# Altium project eeg-measurement-circuit.PrjPcb (part 1 of 3)
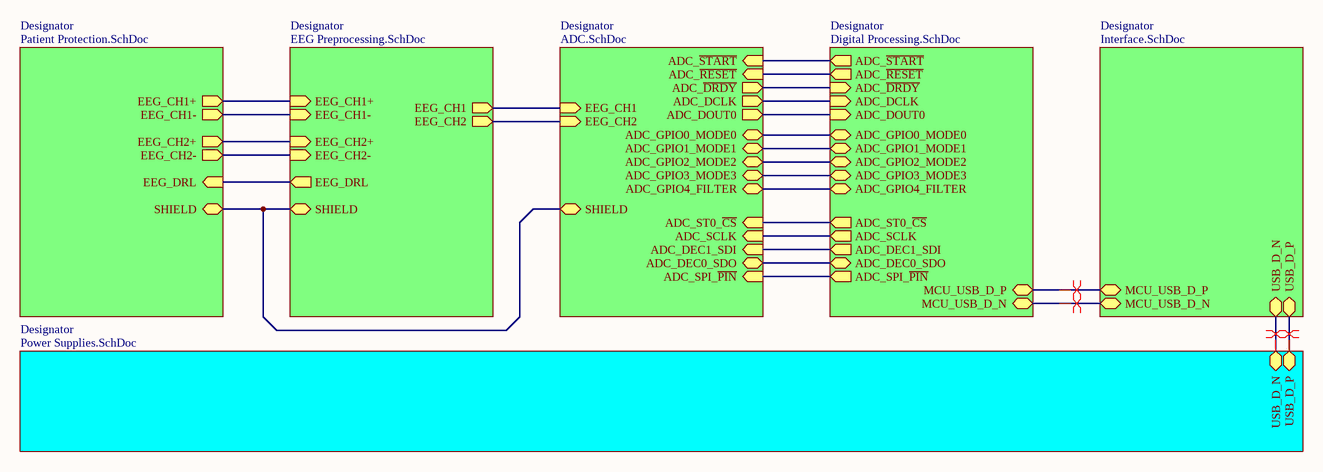
[diagram p0: Block Diagram.SchDoc]
7 sheets, 331 parts. Net scope: hierarchical (ports join the sheet entries above them; power ports are global).
Board files: PCB1.PcbDoc, PCB2.PcbDoc
Sheets:
  Block Diagram.SchDoc
    Designator = Power Supplies.SchDoc
    Designator = EEG Preprocessing.SchDoc
    Designator = ADC.SchDoc
    Designator = Digital Processing.SchDoc
    Designator = Interface.SchDoc
    Designator = Patient Protection.SchDoc

## Sheet Block Diagram.SchDoc: EEG Measurement Circuit
size A3; Date: 24/01/2025; DrawnBy: Giang Phan Truong; Revision: 1.1.0; SheetNumber: 1; SheetTotal: 7

### Sub-sheets
Designator = Power Supplies.SchDoc: USB_D_N (bidir), USB_D_P (bidir)
Designator = EEG Preprocessing.SchDoc: EEG_CH1+ (in), EEG_CH1- (in), EEG_CH2+ (in), EEG_CH2- (in), EEG_CH1 (out), EEG_CH2 (out), EEG_DRL (out), SHIELD (bidir)
Designator = ADC.SchDoc: EEG_CH2 (in), EEG_CH1 (in), SHIELD (bidir), ADC_GPIO0_MODE0 (bidir), ADC_GPIO1_MODE1 (bidir), ADC_GPIO2_MODE2 (bidir), ADC_GPIO3_MODE3 (bidir), ADC_GPIO4_FILTER (bidir), ADC_ST0_~{CS} (in), ADC_SCLK (in), ADC_DEC1_SDI (in), ADC_DEC0_SDO (bidir), ADC_SPI_~{PIN} (in), ADC_~{START} (in), ADC_~{RESET} (in), ADC_~{DRDY} (out), ADC_DCLK (out), ADC_DOUT0 (out)
Designator = Digital Processing.SchDoc: ADC_GPIO0_MODE0 (bidir), ADC_GPIO1_MODE1 (bidir), ADC_GPIO2_MODE2 (bidir), ADC_GPIO3_MODE3 (bidir), ADC_GPIO4_FILTER (bidir), ADC_ST0_~{CS} (out), ADC_SCLK (out), ADC_DEC1_SDI (out), ADC_DEC0_SDO (bidir), ADC_SPI_~{PIN} (out), ADC_~{START} (out), ADC_~{RESET} (out), ADC_~{DRDY} (in), ADC_DCLK (in), ADC_DOUT0 (in), MCU_USB_D_P (bidir), MCU_USB_D_N (bidir)
Designator = Interface.SchDoc: USB_D_P (bidir), USB_D_N (bidir), MCU_USB_D_P (bidir), MCU_USB_D_N (bidir)
Designator = Patient Protection.SchDoc: EEG_CH1+ (out), EEG_CH1- (out), EEG_CH2- (out), EEG_CH2+ (out), EEG_DRL (in), SHIELD (bidir)

### Nets
GPIO0_MODE0: sheet Designator/ADC_GPIO0_MODE0, sheet Designator/ADC_GPIO0_MODE0
GPIO1_MODE1: sheet Designator/ADC_GPIO1_MODE1, sheet Designator/ADC_GPIO1_MODE1
GPIO2_MODE2: sheet Designator/ADC_GPIO2_MODE2, sheet Designator/ADC_GPIO2_MODE2
GPIO3_MODE3: sheet Designator/ADC_GPIO3_MODE3, sheet Designator/ADC_GPIO3_MODE3
GPIO4_FILTER: sheet Designator/ADC_GPIO4_FILTER, sheet Designator/ADC_GPIO4_FILTER
MCU_USB_D_N: sheet Designator/MCU_USB_D_N, sheet Designator/MCU_USB_D_N
MCU_USB_D_P: sheet Designator/MCU_USB_D_P, sheet Designator/MCU_USB_D_P
SHIELD: sheet Designator/SHIELD, sheet Designator/SHIELD, sheet Designator/SHIELD
USB_D_N: sheet Designator/USB_D_N, sheet Designator/USB_D_N
USB_D_P: sheet Designator/USB_D_P, sheet Designator/USB_D_P
NetC300_2: sheet Designator/EEG_CH1+, sheet Designator/EEG_CH1+
NetC301_2: sheet Designator/EEG_CH1, sheet Designator/EEG_CH1
NetC303_1: sheet Designator/EEG_CH1-, sheet Designator/EEG_CH1-
NetC309_2: sheet Designator/EEG_CH2+, sheet Designator/EEG_CH2+
NetC310_2: sheet Designator/EEG_CH2, sheet Designator/EEG_CH2
NetC312_1: sheet Designator/EEG_CH2-, sheet Designator/EEG_CH2-
NetC318_1: sheet Designator/EEG_DRL, sheet Designator/EEG_DRL
NetR413_2: sheet Designator/ADC_~{START}, sheet Designator/ADC_~{START}
NetR414_2: sheet Designator/ADC_~{RESET}, sheet Designator/ADC_~{RESET}
NetR420_2: sheet Designator/ADC_SPI_~{PIN}, sheet Designator/ADC_SPI_~{PIN}
NetU400_16: sheet Designator/ADC_ST0_~{CS}, sheet Designator/ADC_ST0_~{CS}
NetU400_17: sheet Designator/ADC_SCLK, sheet Designator/ADC_SCLK
NetU400_18: sheet Designator/ADC_DEC1_SDI, sheet Designator/ADC_DEC1_SDI
NetU400_19: sheet Designator/ADC_DEC0_SDO, sheet Designator/ADC_DEC0_SDO
NetU400_27: sheet Designator/ADC_DOUT0, sheet Designator/ADC_DOUT0
NetU400_28: sheet Designator/ADC_DCLK, sheet Designator/ADC_DCLK
NetU400_29: sheet Designator/ADC_~{DRDY}, sheet Designator/ADC_~{DRDY}

### Layout directives
differential pair: MCU_USB_D_N, MCU_USB_D_P, USB_D_N, USB_D_P

### Notes on the sheet
- Project Name:
- Size
- Size:
- A3
- Revision:
- Drawn By:
- Date:
- File:
- Last Modified:
- Checked By:
- Sheet
- of

## Sheet Power Supplies.SchDoc: EEG Measurement Circuit
size A3; Date: 24/01/2025; DrawnBy: Giang Phan Truong; SheetNumber: 2; SheetTotal: 7
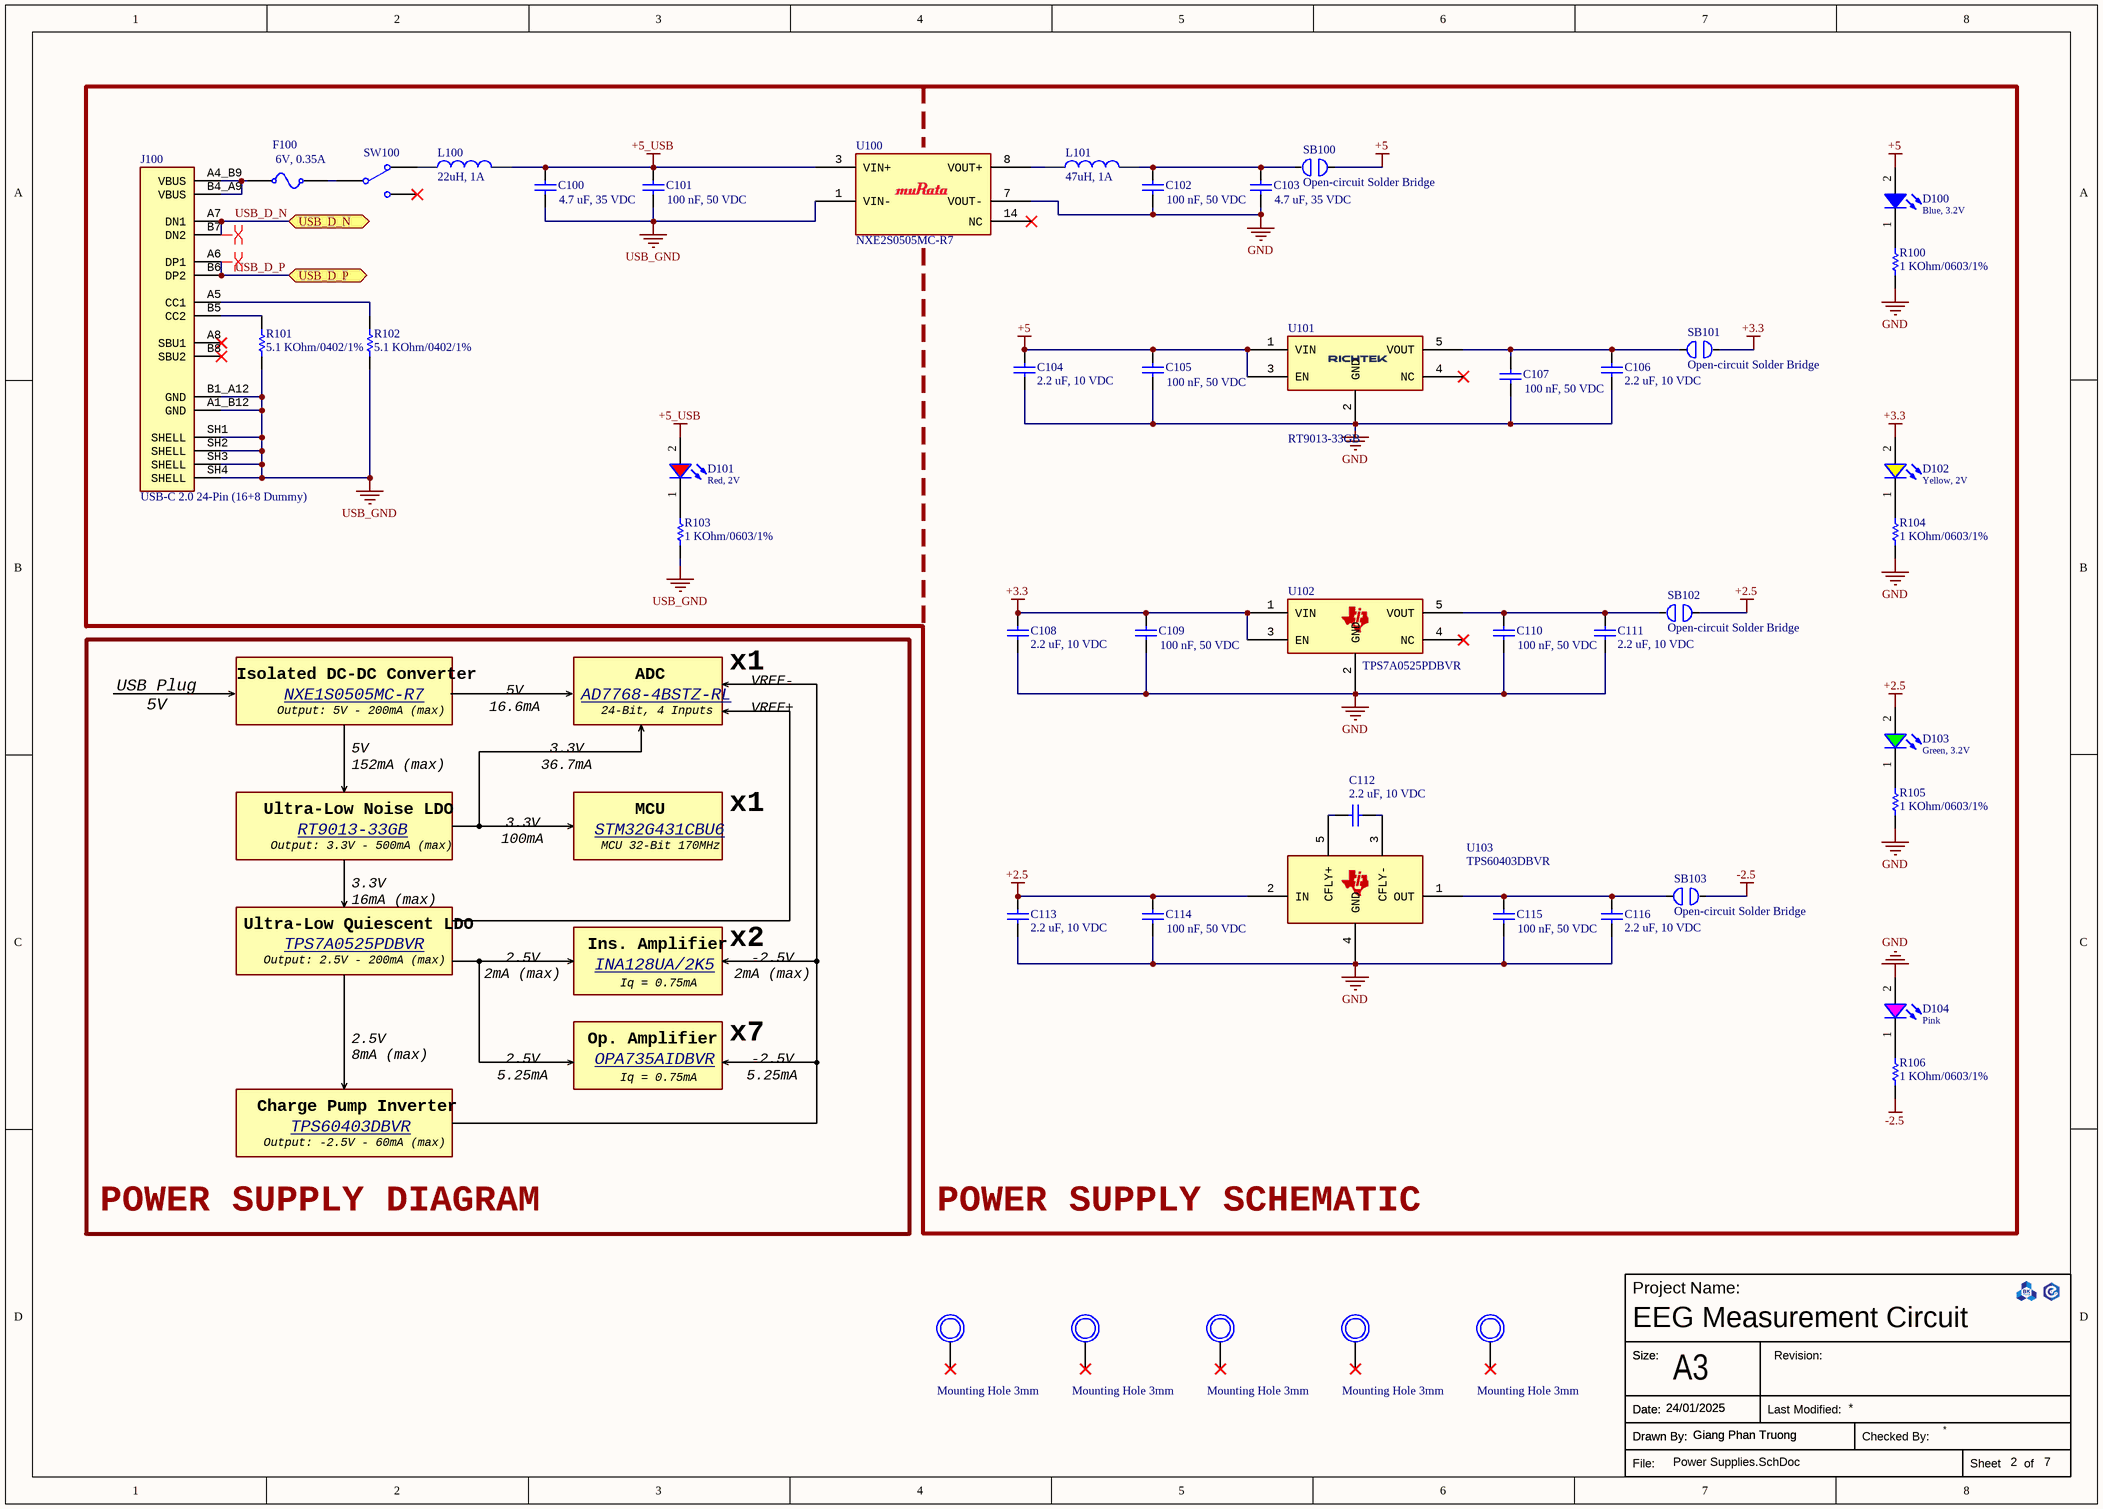
[diagram p1: Power Supplies.SchDoc]

### Parts
C100  4.7 uF, 35 VDC  [CAP_0603]
C101  100 nF, 50 VDC  [CAP_0603]
C102  100 nF, 50 VDC  [CAP_0603]
C103  4.7 uF, 35 VDC  [CAP_0603]
C104  2.2 uF, 10 VDC  [CAP_0603]
C105  100 nF, 50 VDC  [CAP_0603]
C106  2.2 uF, 10 VDC  [CAP_0603]
C107  100 nF, 50 VDC  [CAP_0603]
C108  2.2 uF, 10 VDC  [CAP_0603]
C109  100 nF, 50 VDC  [CAP_0603]
C110  100 nF, 50 VDC  [CAP_0603]
C111  2.2 uF, 10 VDC  [CAP_0603]
C112  2.2 uF, 10 VDC  [CAP_0603]
C113  2.2 uF, 10 VDC  [CAP_0603]
C114  100 nF, 50 VDC  [CAP_0603]
C115  100 nF, 50 VDC  [CAP_0603]
C116  2.2 uF, 10 VDC  [CAP_0603]
D100  Blue, 3.2V  [WL-SMCW_0603_H=0.7mm]
D101  Red, 2V  [WL-SMCW_0603_H=0.7mm]
D102  Yellow, 2V  [WL-SMCW_0603_H=0.7mm]
D103  Green, 3.2V  [WL-SMCW_0603_H=0.7mm]
D104  Pink  [WL-SMCW_0603_H=0.7mm]
F100  6V, 0.35A  [Fuse_SMD_1206]
H100  Mounting Hole 3mm  [3mm with via]
H101  Mounting Hole 3mm  [3mm with via]
H102  Mounting Hole 3mm  [3mm with via]
H103  Mounting Hole 3mm  [3mm with via]
H?  Mounting Hole 3mm  [3mm with via]
J100  value USB-C 2.0 24-Pin (16+8 Dummy)  [GCT_USB4105-GF-A]  (hidden comment: USB4105-GF-A)
L100  22uH, 1A  [Inductor_CDRH4D28]
L101  47uH, 1A  [Inductor_CDRH4D28]
R100  value 1 KOhm/0603/1%  [R0603]  (hidden comment: Resistor 1 KOhm 0603 1%)
R101  value 5.1 KOhm/0402/1%  [R0402]  (hidden comment: Resistor 5.1 KOhm 0402)
R102  value 5.1 KOhm/0402/1%  [R0402]  (hidden comment: Resistor 5.1 KOhm 0402)
R103  value 1 KOhm/0603/1%  [R0603]  (hidden comment: Resistor 1 KOhm 0603 1%)
R104  value 1 KOhm/0603/1%  [R0603]  (hidden comment: Resistor 1 KOhm 0603 1%)
R105  value 1 KOhm/0603/1%  [R0603]  (hidden comment: Resistor 1 KOhm 0603 1%)
R106  value 1 KOhm/0603/1%  [R0603]  (hidden comment: Resistor 1 KOhm 0603 1%)
SB100  Open-circuit Solder Bridge  [SolderBridgeOpen]
SB101  Open-circuit Solder Bridge  [SolderBridgeOpen]
SB102  Open-circuit Solder Bridge  [SolderBridgeOpen]
SB103  Open-circuit Solder Bridge  [SolderBridgeOpen]
SW100  450404015514  [450404015514]  (value not drawn)
U100  NXE2S0505MC-R7  [NXE2_SINGLE_SURFACE_MUR]
U101  RT9013-33GB  [SOT-23-5_RIT-L]
U102  TPS7A0525PDBVR  [DBV0005A_L]
U103  TPS60403DBVR  [SOT95P280X145-5N]

### Blocks framed on the sheet
POWER SUPPLY SCHEMATIC: C100-C116 D100-D104 F100 J100 L100 L101 R100-R106 SB100-SB103 SW100 U100-U103

### Ports
USB_D_N (bidir, see Block Diagram[7B], Interface[3B]), USB_D_P (bidir, see Block Diagram[7B], Interface[3B])

### Nets
+2.5: C113.2 C114.2 D103.2(A) SB102.1 U103.2(IN)
+3.3: C108.2 C109.2 D102.2(A) SB101.1 U102.1(VIN) U102.3(EN)
+5: C104.2 C105.2 D100.2(A) SB100.1 U101.1(VIN) U101.3(EN)
+5_USB: C100.2 C101.2 D101.2(A) L100.2 U100.3(VIN+)
-2.5: R106.2 SB103.1
GND: C102.1 C103.1 C104.1 C105.1 C106.1 C107.1 C108.1 C109.1 C110.1 C111.1 C113.1 C114.1 C115.1 C116.1 D104.2(A) R100.2 R104.2 R105.2 U100.7(VOUT-) U101.2(GND) U102.2(GND) U103.4(GND)
USB_GND: C100.1 C101.1 J100.A1_B12(GND) J100.B1_A12(GND) J100.SH1(SHELL) J100.SH2(SHELL) J100.SH3(SHELL) J100.SH4(SHELL) R101.1 R102.1 R103.1 U100.1(VIN-)
USB_D_N: J100.A7(DN1) J100.B7(DN2) ; port USB_D_N
USB_D_P: J100.A6(DP1) J100.B6(DP2) ; port USB_D_P
NetC102_2: C102.2 C103.2 L101.2 SB100.2
NetC106_2: C106.2 C107.2 SB101.2 U101.5(VOUT)
NetC110_2: C110.2 C111.2 SB102.2 U102.5(VOUT)
NetC112_1: C112.1 U103.3(CFLY-)
NetC112_2: C112.2 U103.5(CFLY+)
NetC115_2: C115.2 C116.2 SB103.2 U103.1(OUT)
NetD100_1: D100.1(K) R100.1
NetD101_1: D101.1(K) R103.2
NetD102_1: D102.1(K) R104.1
NetD103_1: D103.1(K) R105.1
NetD104_1: D104.1(K) R106.1
NetF100_0: F100.0 J100.A4_B9(VBUS) J100.B4_A9(VBUS)
NetF100_1: F100.1 SW100.COM
NetJ100_A5: J100.A5(CC1) R102.2
NetJ100_B5: J100.B5(CC2) R101.2
NetL100_1: L100.1 SW100.L1
NetL101_1: L101.1 U100.8(VOUT+)

Not connected (* = marked no-connect by the designer): H100 0; H101 0; H102 0; H103 0; H? 0; J100 A8(SBU1)* B8(SBU2)*; SW100 L2*; U100 14(NC)*; U101 4(NC)*; U102 4(NC)*

### Layout directives
differential pair: USB_D_N, USB_D_P

### Notes on the sheet
- USB Plug
  5V
- Isolated DC-DC Converter
- Output: 5V - 200mA (max)
- NXE1S0505MC-R7 <https://www.digikey.com/en/products/detail/murata-power-solutions-inc/NXE1S0505MC-R7/5047366>
- 5V
  16.6mA (max)
- AD7768-4BSTZ-RL <https://www.digikey.com/en/products/detail/analog-devices-inc/AD7768-4BSTZ-RL/6056981>
- 24-Bit, 4 Inputs
- ADC
- x1
- VREF-
- 5V
  152mA (max)
- 3.3V
  36.7mA (max)
- VREF+
- Ultra-Low Noise LDO
- Output: 3.3V - 500mA (max)
- RT9013-33GB <https://www.thegioiic.com/rt9013-33gb-ic-on-ap-3-3v-500ma-sot-23-5>
- 3.3V
  100mA (max)
- STM32G431CBU6 <https://www.digikey.com/en/products/detail/stmicroelectronics/STM32G431CBU6/10231569>
- MCU 32-Bit 170MHz
- MCU
- 3.3V
  16mA (max)
- Ultra-Low Quiescent LDO
- Output: 2.5V - 200mA (max)
- TPS7A0525PDBVR <https://www.digikey.com/en/products/detail/texas-instruments/TPS7A0525PDBVR/9489224>
- 2.5V
  2mA (max)
- Ins. Amplifier
- INA128UA/2K5 <https://www.digikey.com/en/products/detail/texas-instruments/INA128UA-2K5/300998>
- Iq = 0.75mA
- x2
- -2.5V
  2mA (max)
- 2.5V
  8mA (max)
- Op. Amplifier
- x7
- Charge Pump Inverter
- 2.5V
  5.25mA (max)
- OPA735AIDBVR <https://www.digikey.com/en/products/detail/texas-instruments/OPA735AIDBVR/1572946>
- -2.5V
  5.25mA (max)
- Output: -2.5V - 60mA (max)
- TPS60403DBVR <https://www.digikey.com/en/products/detail/texas-instruments/TPS60403DBVR/1672064>
- POWER SUPPLY DIAGRAM
- Project Name:
- Size
- Size:
- A3
- Revision:
- Drawn By:
- Date:
- File:
- Last Modified:
- Checked By:
- Sheet
- of

### Library data of the parts
C100 C103 = 0106034751035: CAP, size 0603, 4.7 uF, 35 VDC; Manufacture Name: Samsung Electro-Mechanics; Manufacture SN: CL10A475KL8NRNC; Capacitance: 4.7 uF; Tolerance: +/-10%; Voltage Rating DC: 35 VDC; ComponentLink2Description: Datasheet; ComponentLink2URL: https://www.mouser.vn/datasheet/2/585/MLCC-1837944.pdf; Operating Temperature: -55 to +125degC; Packaging: Tape and Reel; Mounting Technology: SMT; Size: 0603; Supplier 1 Name: Mouser; Supplier 1 SN: 187-CL10A475KL8NRNC; Supplier 1 URL: https://www.mouser.vn/ProductDetail/Samsung-Electro-Mechanics/CL10A475KL8NRNC?qs=xZ%2FP%252Ba9zWqa0jfvJtp%252BUEg%3D%3D&utm_source=mouser-refine-download&utm_medium=file&utm_campaign=CL10A475KL8NRNC&utm_content=Samsung-Electro-Mechanics; Supplier 2 Name: Digi-Key; Supplier 2 SN: 1276-6794-2-ND; Supplier 2 URL: https://www.digikey.com/en/products/detail/samsung-electro-mechanics/cl10a475kl8nrnc/5961278; Supplier 3 Name: thegioiic; Supplier 3 SN: N/A; Supplier 3 URL: N/A; Value: 4.7 uF, 35 VDC; ComponentLink3Description: Buy; ComponentLink3URL: http://www.tme.vn/Product.aspx?id=1163#page=pro_info
C101 C102 C105 C107 C109 C110 C114 C115 = 0106031041050: CAP, size 0603, 100 nF, 50 VDC; Manufacture Name: TDK; Manufacture SN: CGA3E3X8R1H104K080AE; Capacitance: 100 nF; Tolerance: +/-10%; Voltage Rating DC: 50 VDC; ComponentLink2Description: Datasheet; ComponentLink2URL: https://product.tdk.com/system/files/dam/doc/product/capacitor/ceramic/mlcc/catalog/mlcc_automotive_soft_en.pdf?ref_disty=mouser; Operating Temperature: -55 to +125degC; Packaging: Tape and Reel; Mounting Technology: SMT; Size: 0603; Supplier 1 Name: Mouser; Supplier 1 SN: 810-CGA3E3X8R1H104KA; Supplier 1 URL: https://www.mouser.com/ProductDetail/TDK/CGA3E3X8R1H104K080AE?qs=nQSIdc08i%252Bd8g3IRRgU2bw%3D%3D&utm_source=mouser-refine-download&utm_medium=file&utm_campaign=CGA3E3X8R1H104K080AE&utm_content=TDK; Supplier 2 Name: Digi-Key; Supplier 2 SN: 445-173697-2-ND; Supplier 2 URL: https://www.digikey.com/en/products/detail/tdk-corporation/cga3e3x8r1h104k080ae/5809262; Supplier 3 Name: thegioiic; Supplier 3 SN: N/A; Supplier 3 URL: N/A; Value: 100 nF, 50 VDC
  C101 C102 C105: ComponentLink3Description: Buy; ComponentLink3URL: http://www.tme.vn/Product.aspx?id=739#page=pro_info
C104 C106 C108 C111-C113 C116 = 0106032251010: CAP, size 0603, 2.2 uF, 10 VDC; Manufacture Name: Samsung Electro-Mechanics; Manufacture SN: CL10A225KP8NNWC; Capacitance: 2.2 uF; Tolerance: +/-10%; Voltage Rating DC: 10 VDC; ComponentLink2Description: Datasheet; ComponentLink2URL: https://www.mouser.vn/datasheet/2/585/Samsung_MLCC_1837944-1929650.pdf; Operating Temperature: -55 to +125degC; Packaging: Tape and Reel; Mounting Technology: SMT; Size: 0603; Supplier 1 Name: Mouser; Supplier 1 SN: 187-CL10A225KP8NNWC; Supplier 1 URL: https://www.mouser.vn/ProductDetail/Samsung-Electro-Mechanics/CL10A225KP8NNWC?qs=f6khj2Jg0Fj5oIVDjMV6rg%3D%3D&utm_source=mouser-refine-download&utm_medium=file&utm_campaign=CL10A225KP8NNWC&utm_content=Samsung-Electro-Mechanics; Supplier 2 Name: Digi-Key; Supplier 2 SN: 1276-CL10A225KP8NNWCTR-ND; Supplier 2 URL: https://www.digikey.com/en/products/detail/samsung-electro-mechanics/cl10a225kp8nnwc/16572766; Supplier 3 Name: thegioiic; Supplier 3 SN: N/A; Supplier 3 URL: N/A; Value: 2.2 uF, 10 VDC
D100 = 160603BlueBlur: WL-SMCW SMT Mono-color Chip LED Blur, size 0603, Blue, 3.2V, 140deg; Color: Blue; Size: 0603; Type: Blur; ComponentLink1Description: Datasheet link; ComponentLink1URL: N/A; ComponentLink2Description: Supplier 1 URL; ComponentLink2URL: https://www.mouser.vn/ProductDetail/ams-OSRAM/LB-Q39E-L2OO-35-1?qs=74fRo9GAWsz%2FeNvglIOl1w%3D%3D; ComponentLink3Description: Supplier 2 URL; ComponentLink3URL: https://www.digikey.com/en/products/detail/ams-osram-usa-inc/LB-Q39E-N1OO-35-1/2176321; ComponentLink4Description: Supplier 3 URL; ComponentLink4URL: N/A; Supplier 1 Name: Mouser; Supplier 1 SN: 720-LBQ39EL2N2351; Supplier 1 URL: https://www.mouser.vn/ProductDetail/ams-OSRAM/LB-Q39E-L2OO-35-1?qs=74fRo9GAWsz%2FeNvglIOl1w%3D%3D; Supplier 2 Name: Digi-Key; Supplier 2 SN: 475-LBQ39E-N1OO-35-1TR-ND; Supplier 2 URL: https://www.digikey.com/en/products/detail/ams-osram-usa-inc/LB-Q39E-N1OO-35-1/2176321; Supplier 3 Name: ICDayRoi; Supplier 3 SN: N/A; Supplier 3 URL: N/A; Value: Blue, 3.2V; ComponentLink5Description: Buy; ComponentLink5URL: https://www.thegioiic.com/led-xanh-duong-0603-dan-smd-trong-suot-harvatek
D101 = 160603RedClear: WL-SMCW SMT Mono-color Chip LED Waterclear, size 0603, Red, 2V, 140deg; Type: Clear; Color: Red; Size: 0603; ComponentLink1Description: Datasheet link; ComponentLink1URL: N/A; ComponentLink2Description: Supplier 1 URL; ComponentLink2URL: https://www.mouser.vn/ProductDetail/Wurth-Elektronik/150060RS75000?qs=LlUlMxKIyB3QnmZ3fw%2FVCA%3D%3D; ComponentLink3Description: Supplier 2 URL; ComponentLink3URL: https://www.digikey.com/en/products/detail/liteon/LTST-C191KRKT/386837; ComponentLink4Description: Supplier 3 URL; ComponentLink4URL: https://www.thegioiic.com/led-do-0603-dan-smd-trong-suot; Supplier 1 Name: Mouser; Supplier 1 SN: 710-150060RS75000; Supplier 1 URL: https://www.mouser.vn/ProductDetail/Wurth-Elektronik/150060RS75000?qs=LlUlMxKIyB3QnmZ3fw%2FVCA%3D%3D; Supplier 2 Name: Digi-Key; Supplier 2 SN: 160-1447-2-ND; Supplier 2 URL: https://www.digikey.com/en/products/detail/liteon/LTST-C191KRKT/386837; Supplier 3 Name: ICDayRoi; Supplier 3 SN: N/A; Supplier 3 URL: https://www.thegioiic.com/led-do-0603-dan-smd-trong-suot; Value: Red, 2V
D102 = 160603YellowBlur: WL-SMCW SMT Mono-color Chip LED Blur, size 0603, Yellow, 2V, 140deg; Color: Yellow; Size: 0603; Type: Blur; ComponentLink1Description: Datasheet link; ComponentLink1URL: N/A; ComponentLink2Description: Supplier 1 URL; ComponentLink2URL: https://www.mouser.vn/ProductDetail/ROHM-Semiconductor/CSL1901YW1?qs=vvQtp7zwQdO0NUeC1uqWRA%3D%3D; ComponentLink3Description: Supplier 2 URL; ComponentLink3URL: https://www.digikey.com/en/products/detail/rohm-semiconductor/SML-D12Y8WT86/1641801; ComponentLink4Description: Supplier 3 URL; ComponentLink4URL: N/A; Supplier 1 Name: Mouser; Supplier 1 SN: 755-CSL1901YW1; Supplier 1 URL: https://www.mouser.vn/ProductDetail/ROHM-Semiconductor/CSL1901YW1?qs=vvQtp7zwQdO0NUeC1uqWRA%3D%3D; Supplier 2 Name: Digi-Key; Supplier 2 SN: 511-1582-2-ND; Supplier 2 URL: https://www.digikey.com/en/products/detail/rohm-semiconductor/SML-D12Y8WT86/1641801; Supplier 3 Name: ICDayRoi; Supplier 3 SN: N/A; Supplier 3 URL: N/A; Value: Yellow, 2V; ComponentLink5Description: Buy; ComponentLink5URL: https://www.thegioiic.com/led-vang-0603-dan-smd-trong-suot
D103 = 160603GreenBlur: WL-SMCW SMT Mono-color Chip LED Blur, size 0603, Green, 3.2V, 140deg; Color: Green; Size: 0603; Type: Blur; ComponentLink1Description: Datasheet link; ComponentLink1URL: N/A; ComponentLink2Description: Supplier 1 URL; ComponentLink2URL: https://www.mouser.vn/ProductDetail/ROHM-Semiconductor/SMLD12EN1WT86?qs=qSfuJ%252Bfl%2Fd4fR%252B9yZydIwg%3D%3D; ComponentLink3Description: Supplier 2 URL; ComponentLink3URL: https://www.digikey.com/en/products/detail/rohm-semiconductor/SML-D12M8WT86/1641797; ComponentLink4Description: Supplier 3 URL; ComponentLink4URL: N/A; Supplier 1 Name: Mouser; Supplier 1 SN: 755-SMLD12EN1WT86; Supplier 1 URL: https://www.mouser.vn/ProductDetail/ROHM-Semiconductor/SMLD12EN1WT86?qs=qSfuJ%252Bfl%2Fd4fR%252B9yZydIwg%3D%3D; Supplier 2 Name: Digi-Key; Supplier 2 SN: 511-1578-2-ND; Supplier 2 URL: https://www.digikey.com/en/products/detail/rohm-semiconductor/SML-D12M8WT86/1641797; Supplier 3 Name: ICDayRoi; Supplier 3 SN: N/A; Supplier 3 URL: N/A; Value: Green, 3.2V; ComponentLink5Description: Buy; ComponentLink5URL: https://www.thegioiic.com/led-xanh-la-0603-dan-smd-trong-suot
D104 = 160603PinkBlur: WL-SMCW SMT Mono-color Chip LED Blur, size 0603, Pink; Color: Pink; Size: 0603; Type: Blur; ComponentLink1Description: Datasheet link; ComponentLink1URL: N/A; ComponentLink2Description: Supplier 1 URL; ComponentLink2URL: N/A; ComponentLink3Description: Supplier 2 URL; ComponentLink3URL: https://www.digikey.com/en/products/detail/rohm-semiconductor/SMLD12HBC7W1/3587026; ComponentLink4Description: Supplier 3 URL; ComponentLink4URL: N/A; Supplier 1 Name: Mouser; Supplier 1 SN: N/A; Supplier 1 URL: N/A; Supplier 2 Name: Digi-Key; Supplier 2 SN: 846-1108-2-ND; Supplier 2 URL: https://www.digikey.com/en/products/detail/rohm-semiconductor/SMLD12HBC7W1/3587026; Supplier 3 Name: ICDayRoi; Supplier 3 SN: N/A; Supplier 3 URL: N/A; Value: Pink; ComponentLink5Description: Buy; ComponentLink5URL: https://www.thegioiic.com/led-hong-0603-dan-smd-trong-suot
F100 = 061206035006: Resettable Fuse, Size 1206, 6V, 0.35A; Manufacturer: Bourns; Manufacturer Part Number: MF-NSMF035-2; Threshold Current: 100A; Trip Current: 0.75A; Threshold Voltage: 6V; Hold Current: 0.35A; ComponentLink1Description: Datasheet; ComponentLink1URL: https://www.bourns.com/docs/Product-Datasheets/mfnsmf.pdf; Supplier 1 URL: https://www.mouser.vn/ProductDetail/Bourns/MF-NSMF035-2?qs=3eVyCPG4fwnHDrvs%2FGppSw%3D%3D; Supplier 2 URL: https://www.mouser.vn/ProductDetail/Bourns/MF-NSMF035-2?qs=3eVyCPG4fwnHDrvs%2FGppSw%3D%3D; Supplier 3 URL: https://www.thegioiic.com/mf-nsmf035-2-cau-chi-tu-phuc-hoi-1206-6v-0-35a; Value: 6V, 0.35A; Mount: SMD/SMT; Package / Case: 1206; Packaging: Tape and Reel; Supplier 1: Mouser; Supplier 1 Part Number: 652-MF-NSMF035-2; Supplier 2: Digi-Key; Supplier 2 Part Number: MF-NSMF035-2TR-ND; Supplier 3: thegioiic; Supplier 3 Part Number: MF-NSMF035-2; LCSC Part #: N/A
J100 = USB4105-GF-A: USB-C (USB TYPE-C) USB 2.0 Receptacle Connector 24 (16+8 Dummy) Position Surface Mount, Right Angle; Through Hole; MF: {'manufacturer': u'GCT'}; Package: None; Price: None; MP: USB4105-GF-A; Availability: Unavailable; ComponentLink1Description: Buy; ComponentLink1URL: https://www.thegioiic.com/cong-usb-cai-3-1-type-c-16-chan-thang-dan-smd
L100 = IND_22uH_4D28: 22uH 20% 1A SMD Power Inductor 4.8x4.8x2.8 mm; Supply Name: tme; Supply Part Number: 22uH 20% 1A SMD Power Inductor 4.8x4.8x2.8 mm; Supply URL: http://www.tme.vn/Product.aspx?id=1639#page=pro_info; Value: 22uH, 1A; ComponentLink1Description: Buy; ComponentLink1URL: http://tme.vn/Product.aspx?id=1639#page=pro_info
L101 = IND_47uH_4D28: 47uH 20% 1A SMD Power Inductor 4.8x4.8x2.8 mm; Supply Part Number: 22uH 20% 1A SMD Power Inductor 4.8x4.8x2.8 mm; Supply Name: tme; ComponentLink1Description: Buy; ComponentLink1URL: http://www.tme.vn/Product.aspx?id=1640#page=pro_info; Value: 47uH, 1A
R100 R103-R106 = Resistor 1 KOhm 0603 1%: Code 102, 1/10W; ComponentLink1Description: Buy; ComponentLink1URL: https://www.thegioiic.com/dien-tro-1-kohm-0603-1
R101 R102 = Resistor 5.1 KOhm 0402: RC0402FR-135K1L; ComponentLink1Description: Buy; ComponentLink1URL: https://www.digikey.com/en/products/detail/yageo/RC0402FR-135K1L/14286364
SW100 = 450404015514: WS-SLSU Mini Slide Switch, Same Side Connection Side Push, SPDT, 5VDC, 300mA, 240g; Manufacturer: Wurth Elektronik; Manufacturer Part Number: 450404015514; Category: Slide Switches; Match Code: WS-SLSU; Mount: Surface Mount; Operating Temperature Max: 85°C; Operating Temperature Min: -40°C; Packaging: Tape and Reel; Length: 6.7mm; Width: 2.7mm; Height: 1.1mm; Circuit: SPDT; Contact Material: Copper Alloy; Contact Plating: Silver; Operation Force: 240g; Rated Current: 300mA; Rated Voltage: 5VDC; Terminal Material: Copper Alloy; Terminal Plating: Silver; Supplier 1 URL: https://www.mouser.com/ProductDetail/Wurth-Elektronik/450404015514?qs=sPbYRqrBIVk21%2FxsES2IZA%3D%3D; Supplier 2 URL: https://www.digikey.com/en/products/detail/w%C3%BCrth-elektronik/450404015514/9950812; Supplier 3 URL: https://www.thegioiic.com/msk-12c02-cong-tac-truot-7-chan-on-off-smd-chinh-ngang-1p2t-0-5a; LCSC Part #: N/A; ComponentLink1Description: Datasheet; ComponentLink1URL: https://www.we-online.com/redexpert/spec/450404015514?ad; Supplier 1: Mouser; Supplier 1 Part Number: 710-450404015514; Supplier 2: Digi-Key; Supplier 2 Part Number: 732-13665-2-ND; Supplier 3: thegioiic; Supplier 3 Part Number: MSK-12C02; Value: 450404015514
U100 = NXE2S0505MC-R7: Isolated Module DC DC Converter 1 Output 5V 400mA 4.5V - 5.5V Input; Mfr_Name: Murata; RefDes: RefDes; Type: Type; ComponentLink1Description: Buy; ComponentLink1URL: https://www.digikey.com/en/products/detail/murata-power-solutions-inc/NXE2S0505MC-R7/6009739; Value: NXE2S0505MC-R7
U101 = RT9013-33GB: Linear Voltage Regulator IC Positive Fixed 1 Output 500mA SOT-23-5; Mfr_Name: Richtek Technology; RefDes: RefDes; Type: Type; ComponentLink1Description: Buy; ComponentLink1URL: https://www.digikey.com/en/products/detail/richtek-usa-inc/RT9013-33GB/2546347; Value: RT9013-33GB
U102 = TPS7A0525PDBVR: Linear Voltage Regulator IC Positive Fixed 1 Output 200mA SOT-23-5; Mfr_Name: Texas Instruments; TYPE: TYPE; RefDes: RefDes; ComponentLink1Description: Buy; ComponentLink1URL: https://www.digikey.com/en/products/detail/texas-instruments/TPS7A0525PDBVR/9489224; Value: TPS7A0525PDBVR
U103 = TPS60403DBVR: 60mA Charge Pump Voltage Inverter with Fixed 250kHz Operation; MF: Texas Instruments; Mouser-Purchase-URL: https://snapeda.com/shop?store=Mouser&id=1101412; Availability: Unavailable; Price: None; Package: SOT-23-5 Texas Instruments; DigiKey-Purchase-URL: https://snapeda.com/shop?store=DigiKey&id=1101412; MP: TPS60403DBVR; SnapEDA_Link: https://www.snapeda.com/parts/TPS60403DBVR/Texas%20Instruments/view-part/1101412/?ref=snap; Arrow_Electronics-Purchase-URL: https://snapeda.com/shop?store=Arrow+Electronics&id=1101412; Texas_Instruments-Purchase-URL: https://snapeda.com/shop?store=Texas+Instruments&id=1101412; ComponentLink1Description: Buy; ComponentLink1URL: https://www.digikey.com/en/products/detail/texas-instruments/TPS60403DBVR/1672064; Value: TPS60403DBVR

## Sheet EEG Preprocessing.SchDoc: EEG Measurement Circuit
size A2; Date: 24/01/2025; DrawnBy: Giang Phan Truong; SheetNumber: 4; SheetTotal: 7; SPICEModelCacheZASXATAV: <root> / <DocumentId>ZASXATAV</DocumentId> / <CacheFrame Number="0"> / <Model Name="0402_885012205067_10nf" Kind="CKT"> / <Text>******* / .subckt 0402_885012205067_10nF 1 2 / Rser 1 3 0.110942181295 / Lser 2 4 1.63617133E-10 / C1 3 4 0.00000001 / Rpar 3 4 10000000000 / .ends 0402_885012205067_10nF</Text> / </Model> / <Model Name="0402_885012205044_1nf" Kind="CKT"> / <Text>******* / .subckt 0402_885012205044_1nF 1 2 / Rser 1 3 0.2145 / Lser 2 4 0.000000000153 / C1 3 4 0.000000001 / Rpar 3 4 10000000000 / .ends 0402_885012205044_1nF</Text> / </Model> / <Model Name="0402_885012005057_22pf" Kind="CKT"> / <Text>******* / .subckt 0402_885012005057_22pF 1 2 / Rser 1 3 0.1946461244 / Lser 2 4 4.43759844E-10 / C1 3 4 0.000000000022 / Rpar 3 4 10000000000 / .ends 0402_885012005057_22pF</Text> / </Model> / <Model Name="0402_885012005063_220pf" Kind="CKT"> / <Text>******* / .subckt 0402_885012005063_220pF 1 2 / Rser 1 3 0.0328677075671 / Lser 2 4 3.55619232E-10 / C1 3 4 0.00000000022 / Rpar 3 4 10000000000 / .ends 0402_885012005063_220pF</Text> / </Model> / </CacheFrame> / </root>
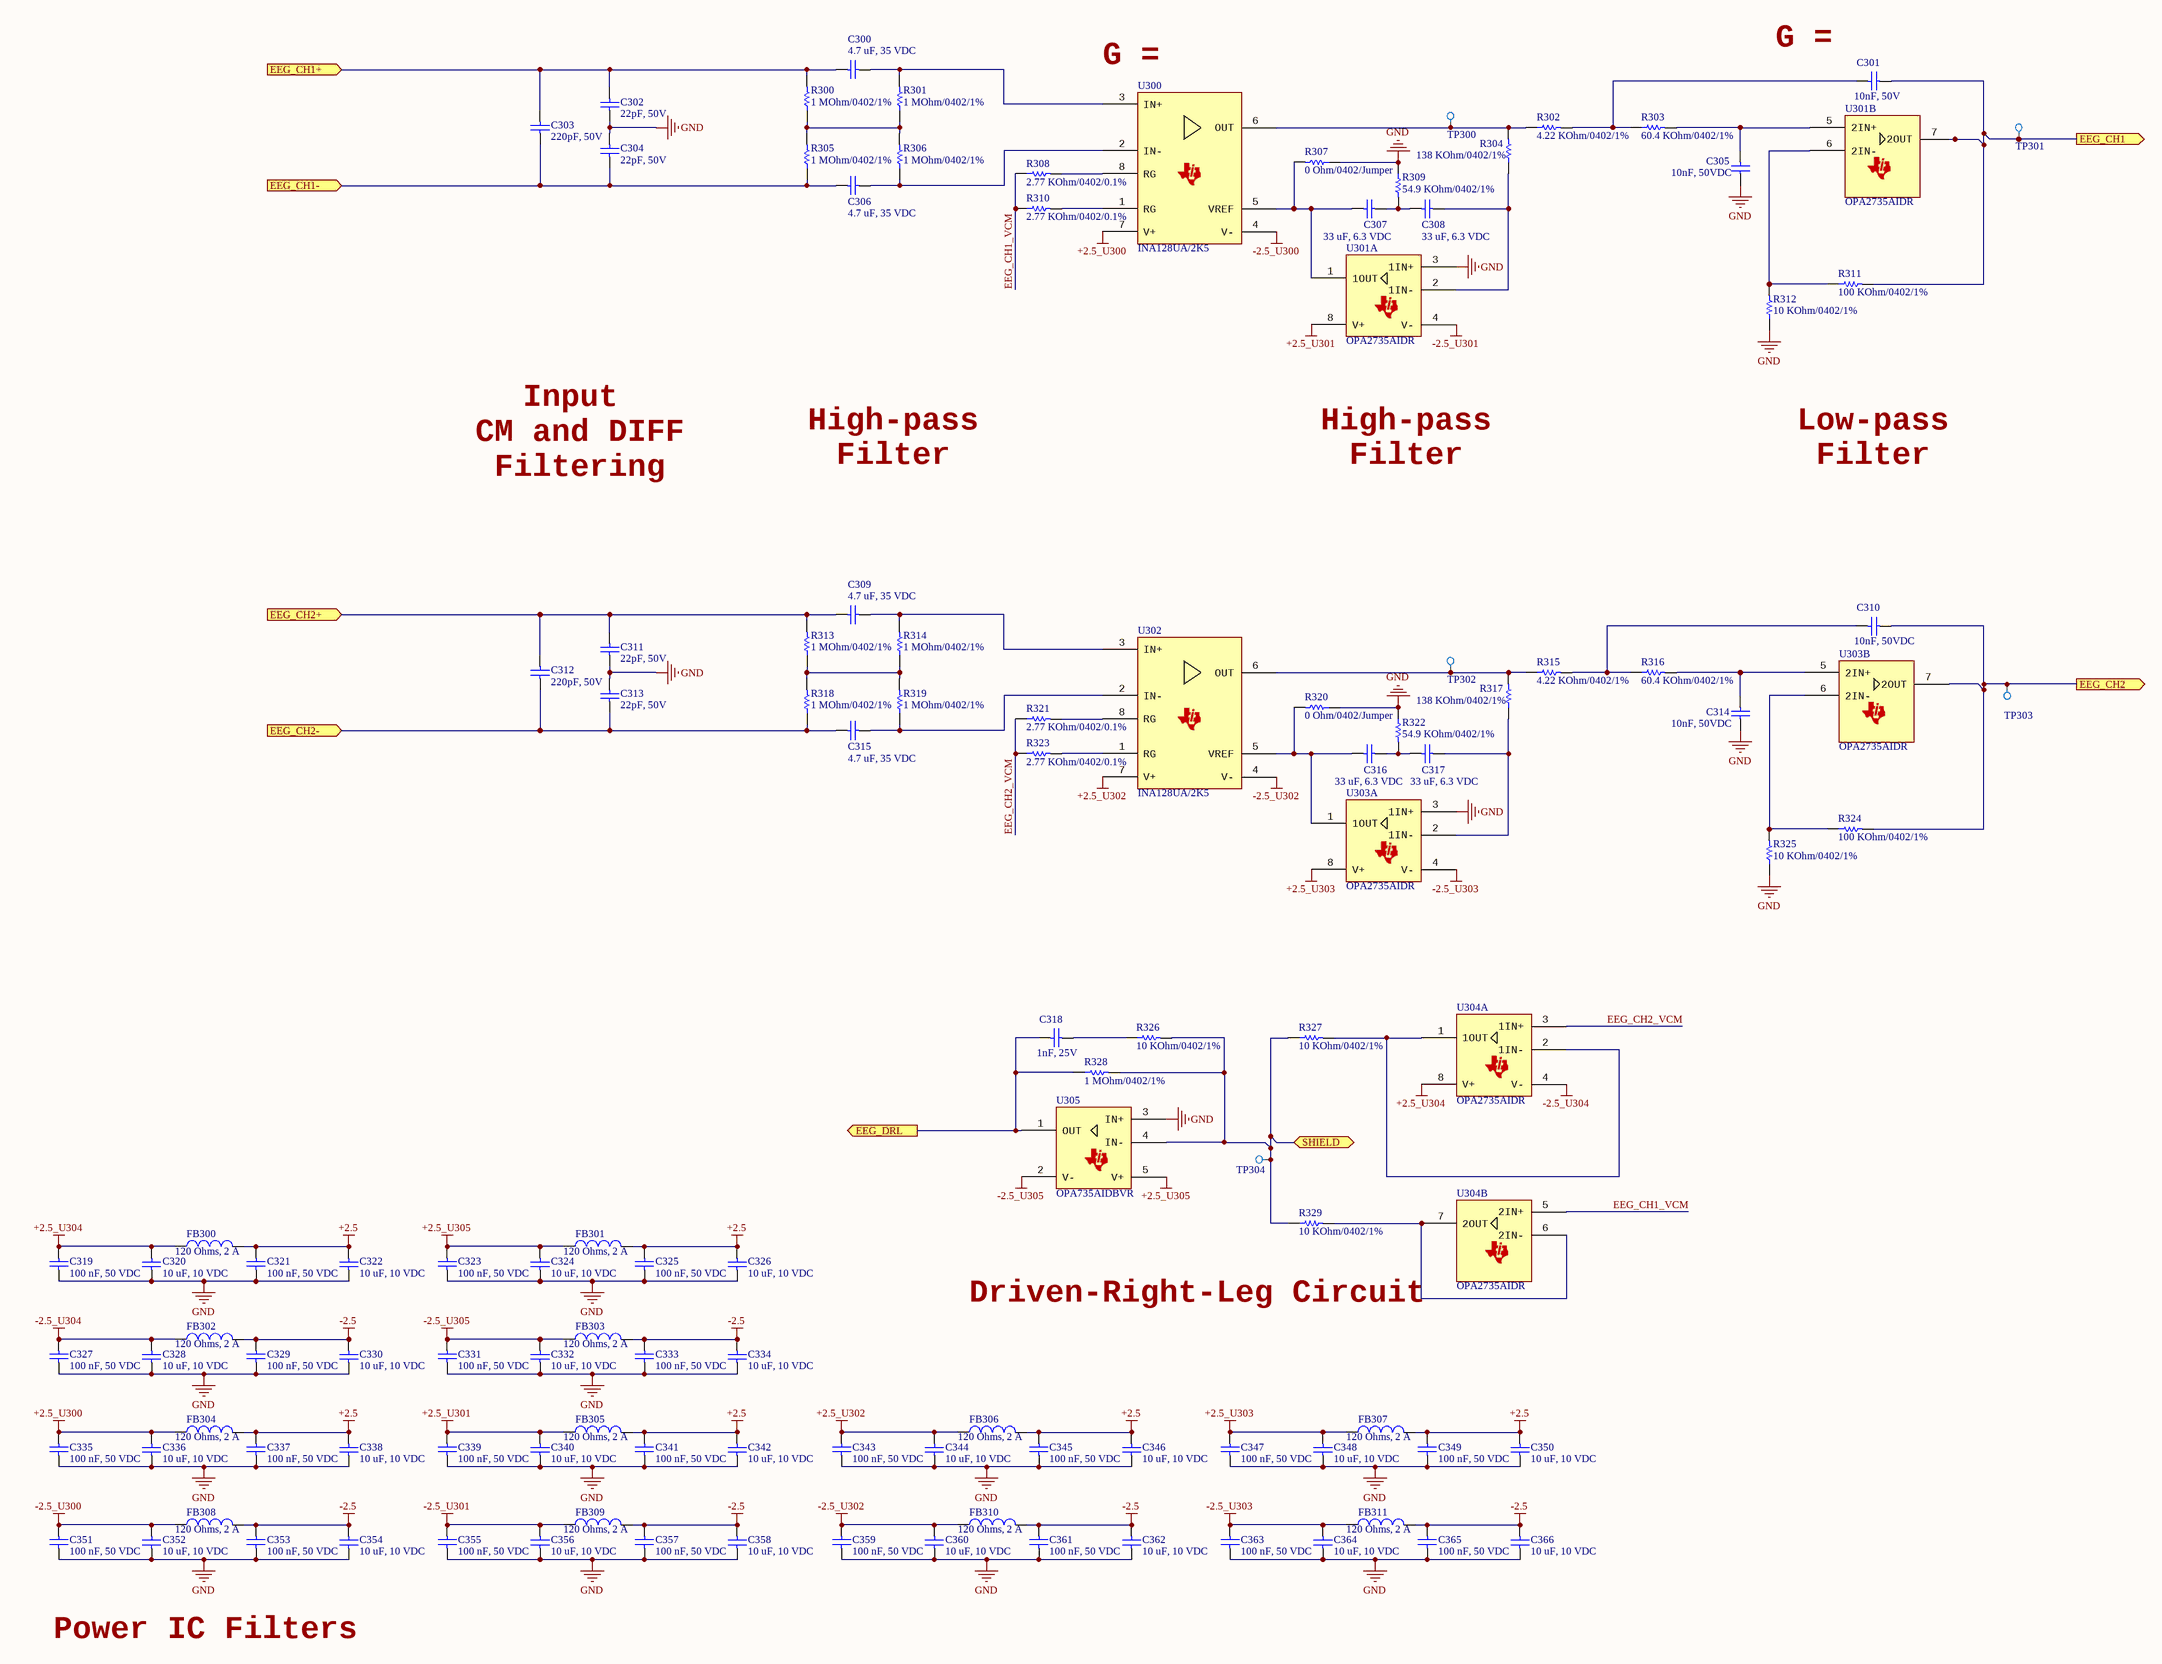
[diagram p2: EEG Preprocessing.SchDoc]

### Parts
C300  4.7 uF, 35 VDC  [CAP_0603]
C301  value 10nF, 50V  [WCAP-CSGP_0402_L1W0.5H0.5]  (hidden comment: 10nF)
C302  value 22pF, 50V  [WCAP-CSGP_0402_L1W0.5H0.5]  (hidden comment: 22pF)
C303  value 220pF, 50V  [WCAP-CSGP_0402_L1W0.5H0.5]  (hidden comment: 220pF)
C304  value 22pF, 50V  [WCAP-CSGP_0402_L1W0.5H0.5]  (hidden comment: 22pF)
C305  value 10nF, 50VDC  [WCAP-CSGP_0402_L1W0.5H0.5]  (hidden comment: 10nF)
C306  4.7 uF, 35 VDC  [CAP_0603]
C307  33 uF, 6.3 VDC  [CAP_0805]
C308  33 uF, 6.3 VDC  [CAP_0805]
C309  4.7 uF, 35 VDC  [CAP_0603]
C310  value 10nF, 50VDC  [WCAP-CSGP_0402_L1W0.5H0.5]  (hidden comment: 10nF)
C311  value 22pF, 50V  [WCAP-CSGP_0402_L1W0.5H0.5]  (hidden comment: 22pF)
C312  value 220pF, 50V  [WCAP-CSGP_0402_L1W0.5H0.5]  (hidden comment: 220pF)
C313  value 22pF, 50V  [WCAP-CSGP_0402_L1W0.5H0.5]  (hidden comment: 22pF)
C314  value 10nF, 50VDC  [WCAP-CSGP_0402_L1W0.5H0.5]  (hidden comment: 10nF)
C315  4.7 uF, 35 VDC  [CAP_0603]
C316  33 uF, 6.3 VDC  [CAP_0805]
C317  33 uF, 6.3 VDC  [CAP_0805]
C318  value 1nF, 25V  [WCAP-CSGP_0402_L1W0.5H0.5]  (hidden comment: 1nF)
C319  100 nF, 50 VDC  [CAP_0603]
C320  10 uF, 10 VDC  [CAP_0603]
C321  100 nF, 50 VDC  [CAP_0603]
C322  10 uF, 10 VDC  [CAP_0603]
C323  100 nF, 50 VDC  [CAP_0603]
C324  10 uF, 10 VDC  [CAP_0603]
C325  100 nF, 50 VDC  [CAP_0603]
C326  10 uF, 10 VDC  [CAP_0603]
C327  100 nF, 50 VDC  [CAP_0603]
C328  10 uF, 10 VDC  [CAP_0603]
C329  100 nF, 50 VDC  [CAP_0603]
C330  10 uF, 10 VDC  [CAP_0603]
C331  100 nF, 50 VDC  [CAP_0603]
C332  10 uF, 10 VDC  [CAP_0603]
C333  100 nF, 50 VDC  [CAP_0603]
C334  10 uF, 10 VDC  [CAP_0603]
C335  100 nF, 50 VDC  [CAP_0603]
C336  10 uF, 10 VDC  [CAP_0603]
C337  100 nF, 50 VDC  [CAP_0603]
C338  10 uF, 10 VDC  [CAP_0603]
C339  100 nF, 50 VDC  [CAP_0603]
C340  10 uF, 10 VDC  [CAP_0603]
C341  100 nF, 50 VDC  [CAP_0603]
C342  10 uF, 10 VDC  [CAP_0603]
C343  100 nF, 50 VDC  [CAP_0603]
C344  10 uF, 10 VDC  [CAP_0603]
C345  100 nF, 50 VDC  [CAP_0603]
C346  10 uF, 10 VDC  [CAP_0603]
C347  100 nF, 50 VDC  [CAP_0603]
C348  10 uF, 10 VDC  [CAP_0603]
C349  100 nF, 50 VDC  [CAP_0603]
C350  10 uF, 10 VDC  [CAP_0603]
C351  100 nF, 50 VDC  [CAP_0603]
C352  10 uF, 10 VDC  [CAP_0603]
C353  100 nF, 50 VDC  [CAP_0603]
C354  10 uF, 10 VDC  [CAP_0603]
C355  100 nF, 50 VDC  [CAP_0603]
C356  10 uF, 10 VDC  [CAP_0603]
C357  100 nF, 50 VDC  [CAP_0603]
C358  10 uF, 10 VDC  [CAP_0603]
C359  100 nF, 50 VDC  [CAP_0603]
C360  10 uF, 10 VDC  [CAP_0603]
C361  100 nF, 50 VDC  [CAP_0603]
C362  10 uF, 10 VDC  [CAP_0603]
C363  100 nF, 50 VDC  [CAP_0603]
C364  10 uF, 10 VDC  [CAP_0603]
C365  100 nF, 50 VDC  [CAP_0603]
C366  10 uF, 10 VDC  [CAP_0603]
FB300  120 Ohms, 2 A  [FER_0603]
FB301  120 Ohms, 2 A  [FER_0603]
FB302  120 Ohms, 2 A  [FER_0603]
FB303  120 Ohms, 2 A  [FER_0603]
FB304  120 Ohms, 2 A  [FER_0603]
FB305  120 Ohms, 2 A  [FER_0603]
FB306  120 Ohms, 2 A  [FER_0603]
FB307  120 Ohms, 2 A  [FER_0603]
FB308  120 Ohms, 2 A  [FER_0603]
FB309  120 Ohms, 2 A  [FER_0603]
FB310  120 Ohms, 2 A  [FER_0603]
FB311  120 Ohms, 2 A  [FER_0603]
R300  value 1 MOhm/0402/1%  [R0402]  (hidden comment: Resistor 1 MOhm 0402 1%)
R301  value 1 MOhm/0402/1%  [R0402]  (hidden comment: Resistor 1 MOhm 0402 1%)
R302  value 4.22 KOhm/0402/1%  [R0402]  (hidden comment: Resistor 4.22 KOhm 0402 1%)
R303  value 60.4 KOhm/0402/1%  [R0402]  (hidden comment: Resistor 60.4 KOhm 0402 1%)
R304  value 138 KOhm/0402/1%  [R0402]  (hidden comment: Resistor 138 KOhm 0402 1%)
R305  value 1 MOhm/0402/1%  [R0402]  (hidden comment: Resistor 1 MOhm 0402 1%)
R306  value 1 MOhm/0402/1%  [R0402]  (hidden comment: Resistor 1 MOhm 0402 1%)
R307  value 0 Ohm/0402/Jumper  [R0402]  (hidden comment: Resistor 0 Ohm 0402)
R308  value 2.77 KOhm/0402/0.1%  [R0402]  (hidden comment: Resistor 2.77 KOhm 0402 1%)
R309  value 54.9 KOhm/0402/1%  [R0402]  (hidden comment: Resistor 54.9 KOhm 0402 1%)
R310  value 2.77 KOhm/0402/0.1%  [R0402]  (hidden comment: Resistor 2.77 KOhm 0402 1%)
R311  value 100 KOhm/0402/1%  [R0402]  (hidden comment: Resistor 100 KOhm 0402 1%)
R312  value 10 KOhm/0402/1%  [R0402]  (hidden comment: Resistor 10 KOhm 0402 1%)
R313  value 1 MOhm/0402/1%  [R0402]  (hidden comment: Resistor 1 MOhm 0402 1%)
R314  value 1 MOhm/0402/1%  [R0402]  (hidden comment: Resistor 1 MOhm 0402 1%)
R315  value 4.22 KOhm/0402/1%  [R0402]  (hidden comment: Resistor 4.22 KOhm 0402 1%)
R316  value 60.4 KOhm/0402/1%  [R0402]  (hidden comment: Resistor 60.4 KOhm 0402 1%)
R317  value 138 KOhm/0402/1%  [R0402]  (hidden comment: Resistor 138 KOhm 0402 1%)
R318  value 1 MOhm/0402/1%  [R0402]  (hidden comment: Resistor 1 MOhm 0402 1%)
R319  value 1 MOhm/0402/1%  [R0402]  (hidden comment: Resistor 1 MOhm 0402 1%)
R320  value 0 Ohm/0402/Jumper  [R0402]  (hidden comment: Resistor 0 Ohm 0402)
R321  value 2.77 KOhm/0402/0.1%  [R0402]  (hidden comment: Resistor 2.77 KOhm 0402 1%)
R322  value 54.9 KOhm/0402/1%  [R0402]  (hidden comment: Resistor 54.9 KOhm 0402 1%)
R323  value 2.77 KOhm/0402/0.1%  [R0402]  (hidden comment: Resistor 2.77 KOhm 0402 1%)
R324  value 100 KOhm/0402/1%  [R0402]  (hidden comment: Resistor 100 KOhm 0402 1%)
R325  value 10 KOhm/0402/1%  [R0402]  (hidden comment: Resistor 10 KOhm 0402 1%)
R326  value 10 KOhm/0402/1%  [R0402]  (hidden comment: Resistor 10 KOhm 0402 1%)
R327  value 10 KOhm/0402/1%  [R0402]  (hidden comment: Resistor 10 KOhm 0402 1%)
R328  value 1 MOhm/0402/1%  [R0402]  (hidden comment: Resistor 1 MOhm 0402 1%)
R329  value 10 KOhm/0402/1%  [R0402]  (hidden comment: Resistor 10 KOhm 0402 1%)
TP300  Testpoint_TH  [TestPoint_THTPad_D1.5mm_Drill0.7mm]  (value not drawn)
TP301  Testpoint_TH  [TestPoint_THTPad_D1.5mm_Drill0.7mm]  (value not drawn)
TP302  Testpoint_TH  [TestPoint_THTPad_D1.5mm_Drill0.7mm]  (value not drawn)
TP303  Testpoint_TH  [TestPoint_THTPad_D1.5mm_Drill0.7mm]  (value not drawn)
TP304  Testpoint_TH  [TestPoint_THTPad_D1.5mm_Drill0.7mm]  (value not drawn)
U300  INA128UA/2K5  [SOIC-8]
U301  OPA2735AIDR  [SOIC-8]  (parts A,B of 2)
U302  INA128UA/2K5  [SOIC-8]
U303  OPA2735AIDR  [SOIC-8]  (parts A,B of 2)
U304  OPA2735AIDR  [SOIC-8]  (parts A,B of 2)
U305  OPA735AIDBVR  [SOT-23]

### Ports
EEG_CH1 (out, see Block Diagram[4B], ADC[1A]), EEG_CH1+ (in, see Block Diagram[3B], Patient Protection[5A]), EEG_CH1- (in, see Block Diagram[3B], Patient Protection[5A]), EEG_CH2 (out, see Block Diagram[4B], ADC[1B]), EEG_CH2+ (in, see Block Diagram[3B], Patient Protection[5C]), EEG_CH2- (in, see Block Diagram[3B], Patient Protection[5B]), EEG_DRL (out, see Block Diagram[3B], Patient Protection[5D]), SHIELD (bidir, see Block Diagram[3B], ADC[3B], Patient Protection[3B])

### Nets
+2.5: C321.1 C322.2 C325.1 C326.2 C337.1 C338.2 C341.1 C342.2 C345.1 C346.2 C349.1 C350.2 FB300.2 FB301.2 FB304.2 FB305.2 FB306.2 FB307.2
+2.5_U300: C335.1 C336.2 FB304.1 U300.7(V+)
+2.5_U301: C339.1 C340.2 FB305.1 U301.8(V+)
+2.5_U302: C343.1 C344.2 FB306.1 U302.7(V+)
+2.5_U303: C347.1 C348.2 FB307.1 U303.8(V+)
+2.5_U304: C319.1 C320.2 FB300.1 U304.8(V+)
+2.5_U305: C323.1 C324.2 FB301.1 U305.5(V+)
-2.5: C329.1 C330.2 C333.1 C334.2 C353.1 C354.2 C357.1 C358.2 C361.1 C362.2 C365.1 C366.2 FB302.2 FB303.2 FB308.2 FB309.2 FB310.2 FB311.2
-2.5_U300: C351.1 C352.2 FB308.1 U300.4(V-)
-2.5_U301: C355.1 C356.2 FB309.1 U301.4(V-)
-2.5_U302: C359.1 C360.2 FB310.1 U302.4(V-)
-2.5_U303: C363.1 C364.2 FB311.1 U303.4(V-)
-2.5_U304: C327.1 C328.2 FB302.1 U304.4(V-)
-2.5_U305: C331.1 C332.2 FB303.1 U305.2(V-)
GND: C302.1 C304.2 C305.1 C311.1 C313.2 C314.1 C319.2 C320.1 C321.2 C322.1 C323.2 C324.1 C325.2 C326.1 C327.2 C328.1 C329.2 C330.1 C331.2 C332.1 C333.2 C334.1 C335.2 C336.1 C337.2 C338.1 C339.2 C340.1 C341.2 C342.1 C343.2 C344.1 C345.2 C346.1 C347.2 C348.1 C349.2 C350.1 C351.2 C352.1 C353.2 C354.1 C355.2 C356.1 C357.2 C358.1 C359.2 C360.1 C361.2 C362.1 C363.2 C364.1 C365.2 C366.1 R307.1 R309.1 R312.1 R320.1 R322.1 R325.1 U301.3(1IN+) U303.3(1IN+) U305.3(IN+)
EEG_CH1_VCM: R308.1 R310.1 U304.5(2IN+)  [project net EEG_CH1_VCM_4]
EEG_CH2_VCM: R321.1 R323.1 U304.3(1IN+)  [project net EEG_CH2_VCM_4]
SHIELD: R326.2 R327.1 R328.2 R329.1 TP304.1 U305.4(IN-) ; port SHIELD
NetC300_1: C300.1 R301.2 U300.3(IN+)
NetC300_2: C300.2 C302.2 C303.2 R300.2 ; port EEG_CH1+
NetC301_1: C301.1 R302.2 R303.1
NetC301_2: C301.2 R311.2 TP301.1 U301.7(2OUT) ; port EEG_CH1
NetC303_1: C303.1 C304.1 C306.2 R305.1 ; port EEG_CH1-
NetC305_2: C305.2 R303.2 U301.5(2IN+)
NetC306_1: C306.1 R306.1 U300.2(IN-)
NetC307_1: C307.1 R307.2 U300.5(VREF) U301.1(1OUT)
NetC307_2: C307.2 C308.1 R309.2
NetC308_2: C308.2 R304.1 U301.2(1IN-)
NetC309_1: C309.1 R314.2 U302.3(IN+)
NetC309_2: C309.2 C311.2 C312.2 R313.2 ; port EEG_CH2+
NetC310_1: C310.1 R315.2 R316.1
NetC310_2: C310.2 R324.2 TP303.1 U303.7(2OUT) ; port EEG_CH2
NetC312_1: C312.1 C313.1 C315.2 R318.1 ; port EEG_CH2-
NetC314_2: C314.2 R316.2 U303.5(2IN+)
NetC315_1: C315.1 R319.1 U302.2(IN-)
NetC316_1: C316.1 R320.2 U302.5(VREF) U303.1(1OUT)
NetC316_2: C316.2 C317.1 R322.2
NetC317_2: C317.2 R317.1 U303.2(1IN-)
NetC318_1: C318.1 R328.1 U305.1(OUT) ; port EEG_DRL
NetC318_2: C318.2 R326.1
NetR300_1: R300.1 R301.1 R305.2 R306.2
NetR302_1: R302.1 R304.2 TP300.1 U300.6(OUT)
NetR308_2: R308.2 U300.8(RG)
NetR310_2: R310.2 U300.1(RG)
NetR311_1: R311.1 R312.2 U301.6(2IN-)
NetR313_1: R313.1 R314.1 R318.2 R319.2
NetR315_1: R315.1 R317.2 TP302.1 U302.6(OUT)
NetR321_2: R321.2 U302.8(RG)
NetR323_2: R323.2 U302.1(RG)
NetR324_1: R324.1 R325.2 U303.6(2IN-)
NetR327_2: R327.2 U304.1(1OUT) U304.2(1IN-)
NetR329_2: R329.2 U304.6(2IN-) U304.7(2OUT)

### Notes on the sheet
- (near U300) G = 10.02V/V
- (near C301) G = 11.0V/V
- Input
  CM and DIFF
  Filtering
- High-pass Filter
  fc = 0.033Hz
- High-pass Filter
  fc = 0.05Hz
- Low-pass Filter
  fc = 1kHz
- Driven-Right-Leg Circuit
- Power IC Filters
- Project Name:
- Date:
- Size
- Size:
- A2
- Last Modified:
- Revision:
- Drawn By:
- File:
- Checked By:
- Sheet
- of

### Library data of the parts
C300 C306 C309 C315 = 0106034751035: as C100 on sheet Power Supplies; ComponentLink2Description: Datasheet; ComponentLink2URL: https://www.mouser.vn/datasheet/2/585/MLCC-1837944.pdf; Operating Temperature: -55 to +125degC; Packaging: Tape and Reel; Mounting Technology: SMT; Size: 0603; Supplier 1 Name: Mouser; Supplier 1 SN: 187-CL10A475KL8NRNC; Supplier 1 URL: https://www.mouser.vn/ProductDetail/Samsung-Electro-Mechanics/CL10A475KL8NRNC?qs=xZ%2FP%252Ba9zWqa0jfvJtp%252BUEg%3D%3D&utm_source=mouser-refine-download&utm_medium=file&utm_campaign=CL10A475KL8NRNC&utm_content=Samsung-Electro-Mechanics; Supplier 2 Name: Digi-Key; Supplier 2 SN: 1276-6794-2-ND; Supplier 2 URL: https://www.digikey.com/en/products/detail/samsung-electro-mechanics/cl10a475kl8nrnc/5961278; Supplier 3 Name: thegioiic; Supplier 3 SN: N/A; Supplier 3 URL: N/A; Value: 4.7 uF, 35 VDC; ComponentLink3Description: Buy; ComponentLink3URL: http://www.tme.vn/Product.aspx?id=1163#page=pro_info
C301 C305 C310 C314 = 885012205067: WCAP-CSGP Multilayer Ceramic Chip Capacitor, General Purpose, size 0402, X7R, 10nF, 50V; Manufacturer: Wurth Elektronik; Case/Size Code: 0402; Capacitance Tolerance: +/-10%; Dissipation Factor: 2.5%; Insulation Resistance: 10GΩ; Technical Reference: X7R0402103K050DFCT10000; Manufacturer Part Number: 885012205067; Category: Multilayer Ceramic Chip Capacitors; Match Code: WCAP-CSGP; ComponentLink1Description: Website Link; ComponentLink1URL: https://www.we-online.com/redexpert/article/885012205067?ad; ComponentLink2Description: Datasheet Link; ComponentLink2URL: https://www.we-online.com/redexpert/spec/885012205067?ad; Mount: Surface Mount; Min Operating Temperature: -55°C; Max Operating Temperature: 125°C; Packaging: Tape and Reel; Length: 1mm; Width: 0.5mm; Height: 0.5mm; Capacitance: 10nF; Ceramic Type: X7R; Rated Voltage (DC): 50V
C302 C304 C311 C313 = 885012005057: WCAP-CSGP Multilayer Ceramic Chip Capacitor, General Purpose, size 0402, NP0, 22pF, 50V; Manufacturer: Wurth Elektronik; Case/Size Code: 0402; Capacitance Tolerance: +/-5%; Insulation Resistance: 10GΩ; Q Factor: 840; Technical Reference: NP00402220J050DFCT10000; Manufacturer Part Number: 885012005057; Category: Multilayer Ceramic Chip Capacitors; Match Code: WCAP-CSGP; ComponentLink1Description: Website Link; ComponentLink1URL: https://www.we-online.com/redexpert/article/885012005057?ad; ComponentLink2Description: Datasheet Link; ComponentLink2URL: https://www.we-online.com/redexpert/spec/885012005057?ad; Mount: Surface Mount; Min Operating Temperature: -55°C; Max Operating Temperature: 125°C; Packaging: Tape and Reel; Length: 1mm; Width: 0.5mm; Height: 0.5mm; Capacitance: 22pF; Ceramic Type: NP0; Rated Voltage (DC): 50V
C303 C312 = 885012005063: WCAP-CSGP Multilayer Ceramic Chip Capacitor, General Purpose, size 0402, NP0, 220pF, 50V; Manufacturer: Wurth Elektronik; Case/Size Code: 0402; Capacitance Tolerance: +/-5%; Insulation Resistance: 10GΩ; Q Factor: 1000; Technical Reference: NP00402221J050DFCT10000; Manufacturer Part Number: 885012005063; Category: Multilayer Ceramic Chip Capacitors; Match Code: WCAP-CSGP; ComponentLink1Description: Website Link; ComponentLink1URL: https://www.we-online.com/redexpert/article/885012005063?ad; ComponentLink2Description: Datasheet Link; ComponentLink2URL: https://www.we-online.com/redexpert/spec/885012005063?ad; Mount: Surface Mount; Min Operating Temperature: -55°C; Max Operating Temperature: 125°C; Packaging: Tape and Reel; Length: 1mm; Width: 0.5mm; Height: 0.5mm; Capacitance: 220pF; Ceramic Type: NP0; Rated Voltage (DC): 50V
C307 C308 C316 C317 = 0108051061025: 33 µF ±20% 6.3V Ceramic Capacitor X5R 0805 (2012 Metric); Manufacture Name: TDK; Manufacture SN: CGA4J1X7S1E106K125AE; Capacitance: 10 uF; Tolerance: +/-10%; Voltage Rating DC: 25 VDC; Operating Temperature: -55 to +125degC; Packaging: Tape and Reel; Mounting Technology: SMT; Size: 0805; Supplier 1 Name: Mouser; Supplier 1 SN: 810-CGA4J1X7S1E106K2; Supplier 1 URL: https://www.mouser.vn/ProductDetail/TDK/CGA4J1X7S1E106K125AE?qs=PqoDHHvF64%252BJvhmUzM2odA%3D%3D&utm_source=mouser-refine-download&utm_medium=file&utm_campaign=CGA4J1X7S1E106K125AE&utm_content=TDK; Supplier 2 Name: Digi-Key; Supplier 2 SN: 445-181411-2-ND; Supplier 2 URL: https://www.digikey.com/en/products/detail/tdk-corporation/cga4j1x7s1e106k125ae/9744777; Supplier 3 Name: thegioiic; Supplier 3 SN: OEM; Supplier 3 URL: N/A; Value: 33 uF, 6.3 VDC; ComponentLink3Description: Buy; ComponentLink3URL: https://www.digikey.com/en/products/detail/tdk-corporation/C2012X5R0J336M125AC/2443464
C318 = 885012205044: WCAP-CSGP Multilayer Ceramic Chip Capacitor, General Purpose, size 0402, X7R, 1nF, 25V; Manufacturer: Wurth Elektronik; Case/Size Code: 0402; Capacitance Tolerance: +/-10%; Dissipation Factor: 3.5%; Insulation Resistance: 10GΩ; Technical Reference: X7R0402102K025DFCT10000; Manufacturer Part Number: 885012205044; Category: Multilayer Ceramic Chip Capacitors; Match Code: WCAP-CSGP; ComponentLink1Description: Website Link; ComponentLink1URL: https://www.we-online.com/redexpert/article/885012205044?ad; ComponentLink2Description: Datasheet Link; ComponentLink2URL: https://www.we-online.com/redexpert/spec/885012205044?ad; Mount: Surface Mount; Min Operating Temperature: -55°C; Max Operating Temperature: 125°C; Packaging: Tape and Reel; Length: 1mm; Width: 0.5mm; Height: 0.5mm; Capacitance: 1nF; Ceramic Type: X7R; Rated Voltage (DC): 25V
C319 C321 C323 C325 C327 C329 C331 C333 C335 C337 C339 C341 C343 C345 C347 C349 C351 C353 C355 C357 C359 C361 C363 C365 = 0106031041050: as C101 on sheet Power Supplies; ComponentLink2Description: Datasheet; ComponentLink2URL: https://product.tdk.com/system/files/dam/doc/product/capacitor/ceramic/mlcc/catalog/mlcc_automotive_soft_en.pdf?ref_disty=mouser; Operating Temperature: -55 to +125degC; Packaging: Tape and Reel; Mounting Technology: SMT; Size: 0603; Supplier 1 Name: Mouser; Supplier 1 SN: 810-CGA3E3X8R1H104KA; Supplier 1 URL: https://www.mouser.com/ProductDetail/TDK/CGA3E3X8R1H104K080AE?qs=nQSIdc08i%252Bd8g3IRRgU2bw%3D%3D&utm_source=mouser-refine-download&utm_medium=file&utm_campaign=CGA3E3X8R1H104K080AE&utm_content=TDK; Supplier 2 Name: Digi-Key; Supplier 2 SN: 445-173697-2-ND; Supplier 2 URL: https://www.digikey.com/en/products/detail/tdk-corporation/cga3e3x8r1h104k080ae/5809262; Supplier 3 Name: thegioiic; Supplier 3 SN: N/A; Supplier 3 URL: N/A; Value: 100 nF, 50 VDC; Buy: https://tme.vn/Product.aspx?id=739#page=pro_info
C320 C322 C324 C326 C328 C330 C332 C334 C336 C338 C340 C342 C344 C346 C348 C350 C352 C354 C356 C358 C360 C362 C364 C366 = 0106031061010: CAP, size 0603, 10 uF, 10 VDC; Manufacture Name: Samsung Electro-Mechanics; Manufacture SN: CL10A106KP8NNWC; Capacitance: 10 uF; Tolerance: +/-10%; Voltage Rating DC: 10 VDC; ComponentLink2Description: Datasheet; ComponentLink2URL: https://www.mouser.vn/datasheet/2/585/MLCC-1837944.pdf; Operating Temperature: -55 to +125degC; Packaging: Tape and Reel; Mounting Technology: SMT; Size: 0603; Supplier 1 Name: Mouser; Supplier 1 SN: 187-CL10A106KP8NNWC; Supplier 1 URL: https://www.mouser.vn/ProductDetail/Samsung-Electro-Mechanics/CL10A106KP8NNWC?qs=xZ%2FP%252Ba9zWqZx8LSX23YqWA%3D%3D&utm_source=mouser-refine-download&utm_medium=file&utm_campaign=CL10A106KP8NNWC&utm_content=Samsung-Electro-Mechanics; Supplier 2 Name: Digi-Key; Supplier 2 SN: 1276-CL10A106KP8NNWCTR-ND; Supplier 2 URL: https://www.digikey.com/en/products/detail/samsung-electro-mechanics/cl10a106kp8nnwc/16572907; Supplier 3 Name: thegioiic; Supplier 3 SN: N/A; Supplier 3 URL: https://www.thegioiic.com/tu-gom-0603-10uf-25v; Value: 10 uF, 10 VDC; Buy: https://tme.vn/Product.aspx?id=1165#page=pro_info
FB300-FB311 = 03060312120225: Ferrite, 0603, 120 Ohms, 2 A; Manufacture Name: Wurth Elektronik; Manufacture SN: 742792625; Tolerance: +/-25%; Maximum DC Current: 2 A; Maximum DC Resistance: 50 mOhms; Test Frequency: 100 MHz; Mounting Technology: SMT; Operating Temperature: -55 to +125degC; Packaging: Tape and Reel; Size: 0603; Supplier 1 SN: 710-742792625; Supplier 1 URL: https://www.mouser.com/ProductDetail/Wurth-Elektronik/742792625?qs=sGAEpiMZZMt1hubY80%2Fs8OCciRuv%2FFk6PJE4za4cFPDWegNO%252Bf6fVw%3D%3D&utm_source=mouser-refine-download&utm_medium=file&utm_campaign=742792625&utm_content=Wurth-Elektronik; Supplier 2 SN: N/A; Supplier 2 URL: N/A; Supplier 3 SN: N/A; Supplier 3 URL: N/A; Supplier 1 Name: Mouser; Supplier 2 Name: Digi-Key; Supplier 3 Name: thegioiic; Impedance: 120 Ohms; Value: 120 Ohms, 2 A; Buy: https://linhkien.cxtvn.com/9545-blm18sg121tn1d-ferrite-bead-120-ohm-0603-1ln-10c.html
R300 R301 R305 R306 R313 R314 R318 R319 R328 = Resistor 1 MOhm 0402 1%: Code 105, 1/16W 1%; ComponentLink1Description: Buy; ComponentLink1URL: https://www.thegioiic.com/dien-tro-1-mohm-0402-1-
R302 R315 = Resistor 4.22 KOhm 0402 1%: 4.22 kOhms ±1% 0.1W, 1/10W Chip Resistor 0402 (1005 Metric) Automotive AEC-Q200 Thick Film; ComponentLink1Description: Buy; ComponentLink1URL: https://www.digikey.com/en/products/detail/panasonic-electronic-components/ERJ-2RKF4221X/192338
R303 R316 = Resistor 60.4 KOhm 0402 1%: 60.4 kOhms ±1% 0.063W, 1/16W Chip Resistor 0402 (1005 Metric) Moisture Resistant Thick Film; ComponentLink1Description: Buy; ComponentLink1URL: https://www.digikey.com/en/products/detail/yageo/RC0402FR-0760K4L/726643
R304 R317 = Resistor 138 KOhm 0402 1%: 138 kOhms ±1% 0.1W, 1/10W Chip Resistor 0402 (1005 Metric) Automotive AEC-Q200, Moisture Resistant Thin Film; ComponentLink1Description: Buy; ComponentLink1URL: https://www.digikey.com/en/products/detail/koa-speer-electronics-inc/RN73R1ETTP1383F25/10000727
R307 R320 = Resistor 0 Ohm 0402: 0 Ohms Jumper Chip Resistor 0402 (1005 Metric) Moisture Resistant Thick Film; ComponentLink1Description: Buy; ComponentLink1URL: https://www.digikey.com/en/products/detail/yageo/RC0402JR-070RL/726406
R308 R310 R321 R323 = Resistor 2.77 KOhm 0402 1%: 2.77 kOhms ±0.1% 0.1W, 1/10W Chip Resistor 0402 (1005 Metric) Automotive AEC-Q200, Moisture Resistant Thin Film; Buy: https://www.digikey.com/en/products/detail/koa-speer-electronics-inc/RN73R1ETTP2771B25/10003222
R309 R322 = Resistor 54.9 KOhm 0402 1%: 138 kOhms ±1% 0.1W, 1/10W Chip Resistor 0402 (1005 Metric) Automotive AEC-Q200, Moisture Resistant Thin Film; ComponentLink1Description: Buy; ComponentLink1URL: https://www.digikey.com/en/products/detail/yageo/RC0402FR-1354K9L/17024812
R311 R324 = Resistor 100 KOhm 0402 1%: Code 104, 1/16W 1%; ComponentLink1Description: Buy; ComponentLink1URL: https://www.thegioiic.com/dien-tro-100-kohm-0402-1-
R312 R325-R327 R329 = Resistor 10 KOhm 0402 1%: Code 103, 1/16W 1%; ComponentLink1Description: Buy; ComponentLink1URL: https://www.thegioiic.com/dien-tro-10-kohm-0402-1-
TP300-TP304 = Testpoint_TH: Test Point TEST-1BK; Supply Name: BanLinhKien; Datasheet: *; Supply Part Number: Test Point TEST-1BK; Supply URL: https://banlinhkien.com/test-point-test1bk-mau-den-5c-p18255999.html
U300 U302 = INA128UA/2K5: Precision, Low Power Instrumentation Amplifiers; ComponentLink1Description: Buy; ComponentLink1URL: https://www.digikey.com/en/products/detail/texas-instruments/INA128UA-2K5/300998; ComponentLink2Description: Datasheet; ComponentLink2URL: https://www.ti.com/lit/ds/symlink/ina129-ep.pdf?ts=1697381225295&ref_url=https%253A%252F%252Fwww.google.com%252F; Value: INA128UA/2K5
U301 U303 U304 = OPA2735AIDR: 0.05μV/°C max, Single-Supply CMOS Operational Amplifiers Zero-drift Series; ComponentLink1Description: Buy; ComponentLink1URL: https://www.digikey.com/en/products/detail/texas-instruments/OPA2735AIDR/1572381; Value: OPA2735AIDR
U305 = OPA735AIDBVR: Zero-Drift Amplifier 1 Circuit Rail-to-Rail SOT-23-5; Mfr_Name: Texas Instruments; RefDes: RefDes; Type: Type; ComponentLink1Description: Buy; ComponentLink1URL: https://www.digikey.com/en/products/detail/texas-instruments/OPA735AIDBVR/1572946; Value: OPA735AIDBVR